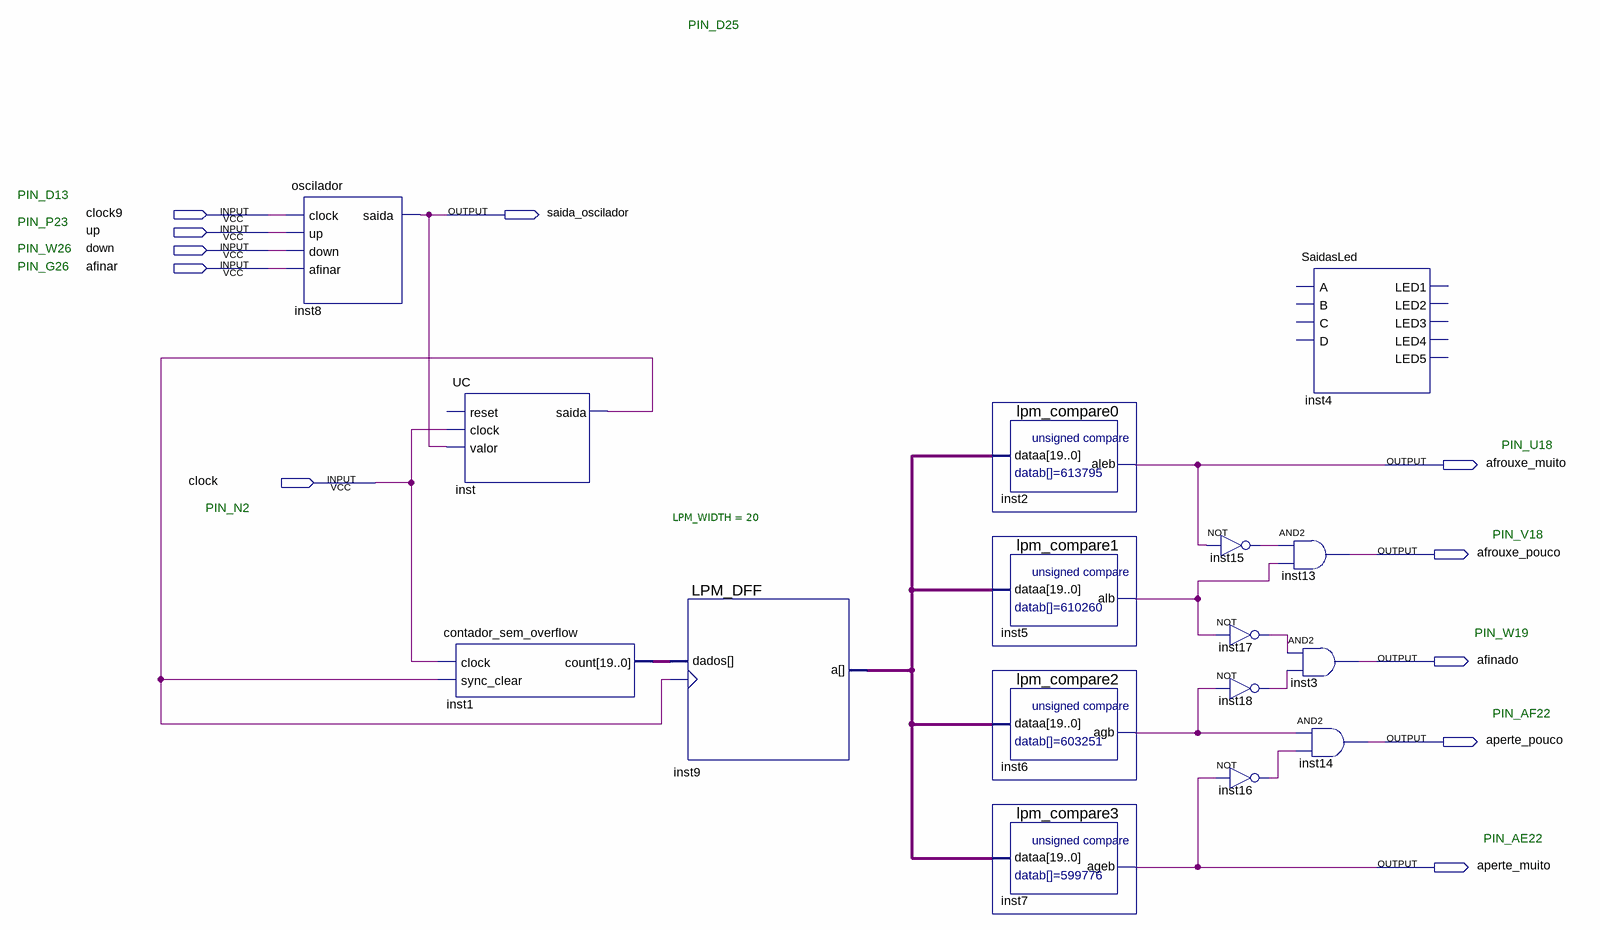
[diagram p0: schematic sheet]
// Quartus schematic afinador_violao.bdf as structural Verilog: 16 symbols, 11 pins
module afinador_violao (
  input  clock9,
  input  up,
  input  down,
  input  afinar,
  input  clock,
  output saida_oscilador,
  output afrouxe_muito,
  output afrouxe_pouco,
  output afinado,
  output aperte_pouco,
  output aperte_muito
);

  wire inst5_alb, inst6_agb, inst15_out, inst16_out, inst17_out, inst18_out, inst_saida;
  wire [19:0] inst1_count, inst9_q;

  oscilador inst8 (.clock(clock9), .up(up), .down(down), .afinar(afinar), .saida(saida_oscilador));
  UC inst (.clock(clock), .valor(saida_oscilador), .saida(inst_saida));  // open: reset
  contador_sem_overflow inst1 (.clock(clock), .sync_clear(inst_saida), .count(inst1_count));
  LPM_DFF #(.LPM_WIDTH(20)) inst9 (.clock(inst_saida), .data(inst1_count), .q(inst9_q));
  lpm_compare0 inst2 (.dataa(inst9_q), .aleb(afrouxe_muito));
  lpm_compare1 inst5 (.dataa(inst9_q), .alb(inst5_alb));
  lpm_compare2 inst6 (.dataa(inst9_q), .agb(inst6_agb));
  lpm_compare3 inst7 (.dataa(inst9_q), .ageb(aperte_muito));
  not inst15 (inst15_out, afrouxe_muito);
  not inst17 (inst17_out, inst5_alb);
  not inst18 (inst18_out, inst6_agb);
  not inst16 (inst16_out, aperte_muito);
  SaidasLed inst4 ();  // open: A, B, C, D, LED1, LED2, LED3, LED4, LED5
  and inst13 (afrouxe_pouco, inst15_out, inst5_alb);
  and inst3 (afinado, inst17_out, inst18_out);
  and inst14 (aperte_pouco, inst6_agb, inst16_out);

  // Notes on the sheet:
  //   PIN_D25
  //   PIN_D13
  //   PIN_P23
  //   PIN_W26
  //   PIN_G26
  //   PIN_U18
  //   PIN_N2
  //   PIN_V18
  //   PIN_W19
  //   PIN_AF22
  //   PIN_AE22
endmodule
